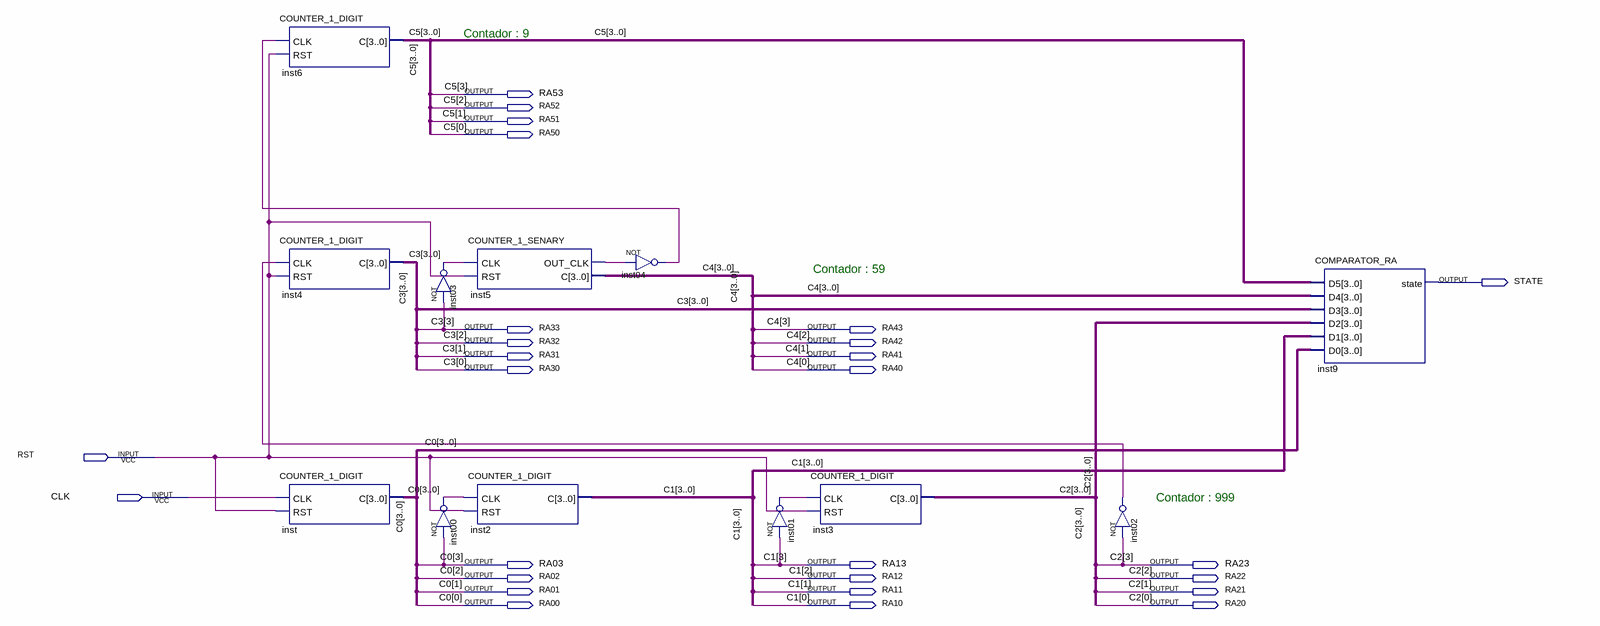
[diagram p0: schematic sheet]
// Quartus schematic tmp.bdf as structural Verilog: 12 symbols, 27 pins
module tmp (
  input  RST,
  input  CLK,
  output RA53,
  output RA52,
  output RA51,
  output RA50,
  output STATE,
  output RA33,
  output RA43,
  output RA32,
  output RA42,
  output RA31,
  output RA41,
  output RA30,
  output RA40,
  output RA03,
  output RA13,
  output RA23,
  output RA02,
  output RA12,
  output RA22,
  output RA01,
  output RA11,
  output RA21,
  output RA00,
  output RA10,
  output RA20
);

  wire inst00_out, inst01_out, inst02_out, inst03_out, inst04_out, inst5_out_clk;

  COUNTER_1_DIGIT inst6 (.CLK(inst04_out), .RST(RST), .C({RA53, RA52, RA51, RA50}));
  COUNTER_1_DIGIT inst4 (.CLK(inst02_out), .RST(RST), .C({RA33, RA32, RA31, RA30}));
  COUNTER_1_DIGIT inst (.CLK(CLK), .RST(RST), .C({RA03, RA02, RA01, RA00}));
  not inst03 (inst03_out, RA33);
  not inst00 (inst00_out, RA03);
  COUNTER_1_SENARY inst5 (.CLK(inst03_out), .RST(RST), .OUT_CLK(inst5_out_clk), .C({RA43, RA42, RA41, RA40}));
  COUNTER_1_DIGIT inst2 (.CLK(inst00_out), .RST(RST), .C({RA13, RA12, RA11, RA10}));
  not inst04 (inst04_out, inst5_out_clk);
  COUNTER_1_DIGIT inst3 (.CLK(inst01_out), .RST(RST), .C({RA23, RA22, RA21, RA20}));
  not inst01 (inst01_out, RA13);
  not inst02 (inst02_out, RA23);
  COMPARATOR_RA inst9 (
    .D5({RA53, RA52, RA51, RA50}), .D4({RA43, RA42, RA41, RA40}), .D3({RA33, RA32, RA31, RA30}),
    .D2({RA23, RA22, RA21, RA20}), .D1({RA13, RA12, RA11, RA10}), .D0({RA03, RA02, RA01, RA00}), .state(STATE));

  // Other names for the same wires on the sheet: C0[3:0] = {RA03, RA02, RA01, RA00};
  //   C1[3:0] = {RA13, RA12, RA11, RA10}; C2[3:0] = {RA23, RA22, RA21, RA20}; C3[3:0] = {RA33, RA32, RA31, RA30};
  //   C4[3:0] = {RA43, RA42, RA41, RA40}; C5[3:0] = {RA53, RA52, RA51, RA50}

  // Notes on the sheet:
  //   Contador : 9
  //   Contador : 59
  //   Contador : 999
endmodule
